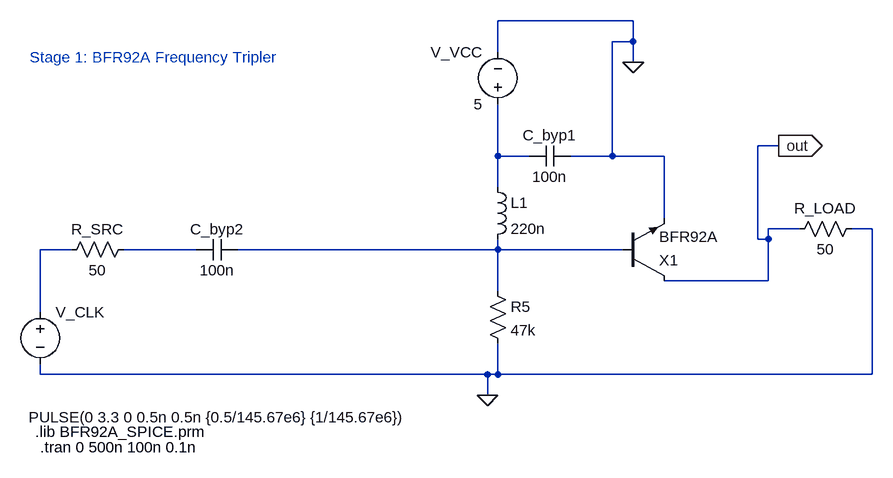
[diagram p0: schematic TX_Chain.asc]
TX_Chain.asc, the LTspice schematic file:
Version 4.1
SHEET 1 1800 900
WIRE 512 -208 304 -208
WIRE 512 -176 512 -208
WIRE 512 -176 480 -176
WIRE 304 -160 304 -208
WIRE 512 -144 512 -176
WIRE 736 -16 704 -16
WIRE 304 0 304 -80
WIRE 352 0 304 0
WIRE 480 0 480 -176
WIRE 480 0 416 0
WIRE 560 0 480 0
WIRE 304 48 304 0
WIRE 560 96 560 0
WIRE 768 112 720 112
WIRE 880 112 848 112
WIRE 704 128 704 -16
WIRE 720 128 720 112
WIRE 720 128 704 128
WIRE -352 144 -400 144
WIRE -160 144 -272 144
WIRE 304 144 304 128
WIRE 304 144 -96 144
WIRE 496 144 304 144
WIRE 720 192 720 128
WIRE 720 192 560 192
WIRE 304 208 304 144
WIRE -400 240 -400 144
WIRE -400 336 -400 320
WIRE 288 336 -400 336
WIRE 304 336 304 288
WIRE 304 336 288 336
WIRE 880 336 880 112
WIRE 880 336 304 336
WIRE 288 368 288 336
FLAG 288 368 0
FLAG 512 -144 0
FLAG 736 -16 out
IOPIN 736 -16 Out
SYMBOL voltage -400 224 R0
WINDOW 3 -18 178 Left 2
SYMATTR InstName V_CLK
SYMATTR Value PULSE(0 3.3 0 0.5n 0.5n {0.5/145.67e6} {1/145.67e6})
SYMBOL res -256 128 R90
WINDOW 0 0 56 VBottom 2
WINDOW 3 32 56 VTop 2
SYMATTR InstName R_SRC
SYMATTR Value 50
SYMBOL res 288 192 R0
SYMATTR InstName R5
SYMATTR Value 47k
SYMBOL NPN 496 192 M180
SYMATTR InstName X1
SYMATTR Value BFR92A
SYMATTR Prefix X
SYMBOL ind 288 32 R0
SYMATTR InstName L1
SYMATTR Value 220n
SYMBOL cap 416 -16 R90
WINDOW 0 0 32 VBottom 2
WINDOW 3 32 32 VTop 2
SYMATTR InstName C_byp1
SYMATTR Value 100n
SYMBOL cap -96 128 R90
WINDOW 0 0 32 VBottom 2
WINDOW 3 32 32 VTop 2
SYMATTR InstName C_byp2
SYMATTR Value 100n
SYMBOL voltage 304 -64 R180
WINDOW 0 24 96 Left 2
WINDOW 3 24 16 Left 2
WINDOW 123 0 0 Left 0
WINDOW 39 0 0 Left 0
SYMATTR InstName V_VCC
SYMATTR Value 5
SYMBOL res 864 96 R90
WINDOW 0 0 56 VBottom 2
WINDOW 3 32 56 VTop 2
SYMATTR InstName R_LOAD
SYMATTR Value 50
TEXT -416 -152 Left 2 ;Stage 1: BFR92A Frequency Tripler
TEXT -408 424 Left 2 !.lib BFR92A_SPICE.prm
TEXT -400 448 Left 2 !.tran 0 500n 100n 0.1n

The netlist it stands for:
* TX_Chain.asc
V_CLK N002 0 PULSE(0 3.3 0 0.5n 0.5n {0.5/145.67e6} {1/145.67e6})
R_SRC N003 N002 50
R5 N004 0 47k
X§X1 out N004 0 BFR92A  ; pins C B E
L1 N001 N004 220n
C_byp1 0 N001 100n
C_byp2 N004 N003 100n
V_VCC N001 0 5
R_LOAD 0 out 50
* Stage 1: BFR92A Frequency Tripler
.lib BFR92A_SPICE.prm
.tran 0 500n 100n 0.1n
.backanno
.end